# Altium schematic sheet CATS-Vega-IMU.SchDoc: CATS Vega
size A4; DocumentNumber: Overview; Revision: V1.0; SheetNumber: 6; SheetTotal: 16; Author: Luca Jost; Subtitle: Inertial Measurement Unit
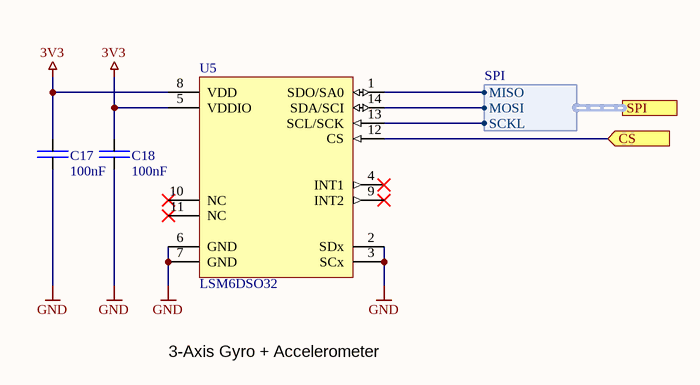
[diagram p0: CATS-Vega-IMU.SchDoc]

## Parts
C17  100nF  [SMD Keramikkondensator 0603]
C18  100nF  [SMD Keramikkondensator 0603]
U5  LSM6DSO32  [SMD IC LGA-14]

## Ports
CS (in), SPI (harness SPI)

## Harnesses
SPI: MISO, MOSI, SCKL

## Nets
3V3: C17.2 C18.2 U5.5(VDDIO) U5.8(VDD)
GND: C17.1 C18.1 U5.2(SDx) U5.3(SCx) U5.6(GND) U5.7(GND)
CS: U5.12(CS) ; port CS
NetU5_1: U5.1(SDO/SA0) ; port SPI.MISO
NetU5_13: U5.13(SCL/SCK) ; port SPI.SCKL
NetU5_14: U5.14(SDA/SCI) ; port SPI.MOSI

Not connected (* = marked no-connect by the designer): U5 4(INT1)* 9(INT2)* 10(NC)* 11(NC)*

## Notes on the sheet
- 3-Axis Gyro + Accelerometer
- Title
- Author:
- Subtitle
- Date:
- Rev:
- File:
- Sheet
- of

## Library data of the parts
C17 C18 = E6 - 100nF: SMD Ceramic Capacitor E6; Unit Price: 0.0024; JLC: C1591
U5 = LSM6DSO32: iNEMO inertial module / ±4/±8/±16/±32 g / ±125/±250/±500/±1000/±2000 dps; ComponentLink1Description: Datasheet; ComponentLink1URL: https://www.st.com/resource/en/datasheet/lsm6dso32.pdf; Digikey: 497-LSM6DSO32CT-ND; Mouser: 511-LSM6DSO32TR; Farnell: 3527117; JLC: C1864162; Unit Price: 4.59